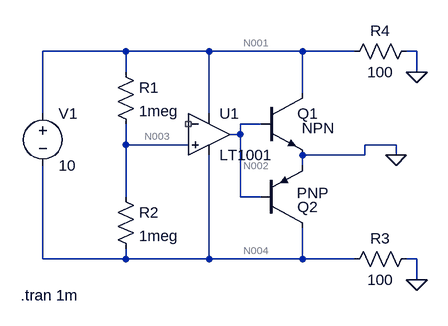
[diagram p0: schematic symmetrierer.asc]
symmetrierer.asc, the LTspice schematic file:
Version 4
SHEET 1 880 680
WIRE 144 32 16 32
WIRE 272 32 144 32
WIRE 416 32 272 32
WIRE 496 32 416 32
WIRE 592 32 576 32
WIRE 144 64 144 32
WIRE 592 64 592 32
WIRE 416 96 416 32
WIRE 16 128 16 32
WIRE 272 128 272 32
WIRE 352 144 320 144
WIRE 320 160 320 144
WIRE 320 160 304 160
WIRE 144 176 144 144
WIRE 240 176 144 176
WIRE 560 176 512 176
WIRE 512 192 512 176
WIRE 512 192 416 192
WIRE 560 192 560 176
WIRE 416 208 416 192
WIRE 144 256 144 176
WIRE 320 256 320 160
WIRE 352 256 320 256
WIRE 16 352 16 208
WIRE 144 352 144 336
WIRE 144 352 16 352
WIRE 272 352 272 192
WIRE 272 352 144 352
WIRE 416 352 416 304
WIRE 416 352 272 352
WIRE 496 352 416 352
WIRE 592 352 576 352
WIRE 592 384 592 352
FLAG 560 192 0
FLAG 592 64 0
FLAG 592 384 0
SYMBOL voltage 16 112 R0
WINDOW 123 0 0 Left 2
WINDOW 39 0 0 Left 2
SYMATTR InstName V1
SYMATTR Value 10
SYMBOL Opamps\\LT1001 272 96 R0
SYMATTR InstName U1
SYMBOL res 128 48 R0
SYMATTR InstName R1
SYMATTR Value 1meg
SYMBOL res 128 240 R0
SYMATTR InstName R2
SYMATTR Value 1meg
SYMBOL npn 352 96 R0
WINDOW 3 63 54 Left 2
SYMATTR InstName Q1
SYMBOL pnp 352 304 M180
WINDOW 3 55 54 Left 2
SYMATTR InstName Q2
SYMBOL res 592 336 R90
WINDOW 0 0 56 VBottom 2
WINDOW 3 32 56 VTop 2
SYMATTR InstName R3
SYMATTR Value 100
SYMBOL res 592 16 R90
WINDOW 0 0 56 VBottom 2
WINDOW 3 32 56 VTop 2
SYMATTR InstName R4
SYMATTR Value 100
TEXT -18 408 Left 2 !.tran 1m

The netlist it stands for:
* symmetrierer.asc
V1 N001 N004 10
XU1 N003 NC_01 N001 N004 N002 LT1001  ; pins In+ In- V+ V- OUT
R1 N001 N003 1meg
R2 N003 N004 1meg
Q1 N001 N002 0 0 NPN
Q2 N004 N002 0 0 PNP
R3 0 N004 100
R4 0 N001 100
.model NPN NPN
.model PNP PNP
.lib standard.bjt
.tran 1m
.lib LTC.lib
.backanno
.end

* Results of the author's LTspice run, read from the files saved beside the schematic
* Operating Point, zero values left out:
*   V(n001) = 5 V
*   V(n004) = -5 V
*   Ic(Q2) = -5 pA
*   Ib(Q2) = 5 pA
*   Ic(Q1) = 5 pA
*   Ib(Q1) = -5 pA
*   I(R4) = -50 mA
*   I(R3) = 50 mA
*   I(R2) = 5 µA
*   I(R1) = 5 µA
*   I(V1) = -52.26 mA
*   Ix(u1:3) = 2.25 mA
*   Ix(u1:4) = -2.25 mA
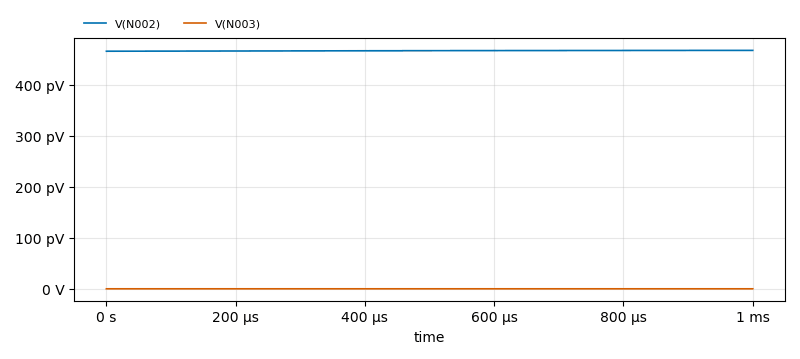
[diagram p1: Transient Analysis of symmetrierer.asc, plotted from the saved traces]
* Transient Analysis, 1 run:
*   V(N002): min 465.7 pV, max 467.3 pV, average 466.6 pV, rms 466.6 pV, last 467.3 pV
*   V(N003): min 0 V, max 1.194 fV, average 0.6318 fV, rms 0.7725 fV, last 0.4441 fV